# EAGLE design PowerBoard (EAGLE 9.2.0)
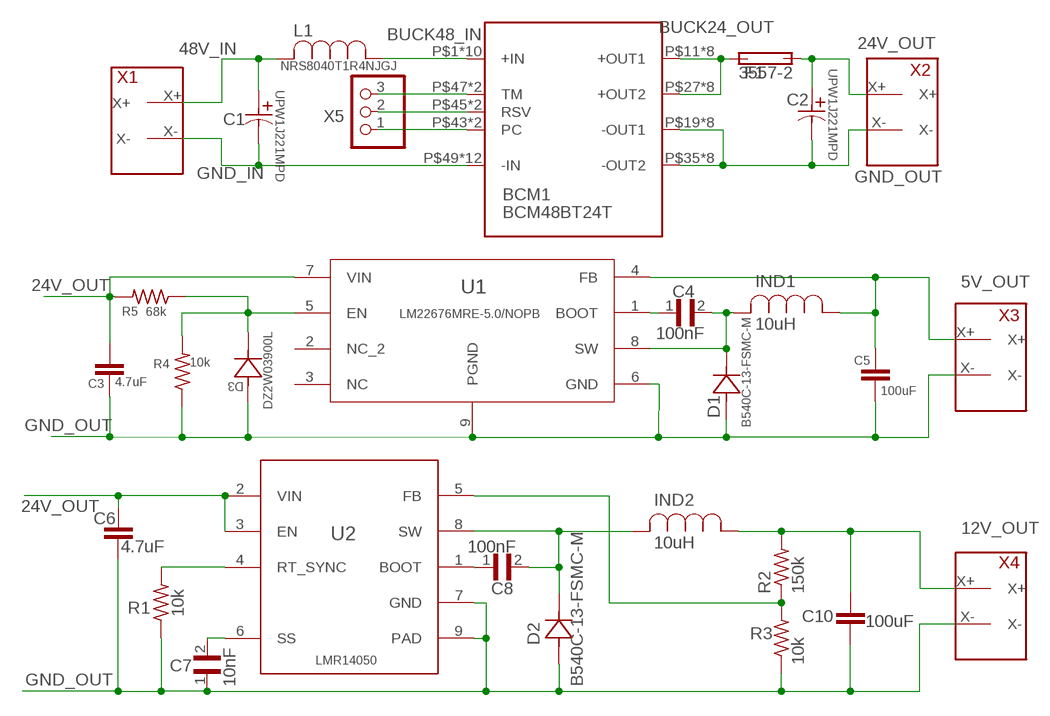
[diagram p0: schematic, sheet 1]

## Parts
BCM1  BCM48BT24T  [BCM48BT24T]
C1  UPW1J221MPD  [PCAP_10X20-THRU-ELECT]
C2  UPW1J221MPD  [PCAP_10X20-THRU-ELECT]
C3  4.7uF  4.7UF0603  [0603]
C4  100nF  GRM21BR60E107ME15L  [CAPC2012X135N]
C5  100uF  10UF-1210-50V-20%  [1210]
C6  4.7uF  4.7UF0603  [0603]
C7  10nF  GRM21BR60E107ME15L  [CAPC2012X135N]
C8  100nF  GRM21BR60E107ME15L  [CAPC2012X135N]
C10  100uF  10UF-1210-50V-20%  [1210]
D1  B540C-13-FSMC-M  [SMC-M]
D2  B540C-13-FSMC-M  [SMC-M]
D3  DZ2W03900L  [MINI2-F3-B]
F1  3557-2  [FUSE_3557-2]
IND1  10uH  ASPI-1040HIA  [11.15X10]
IND2  10uH  ASPI-1040HIA  [11.15X10]
L1  NRS8040T1R4NJGJ  [IND_TAIYO_NRS8040]
R1  10k  R-US_R0603  [R0603]
R2  150k  R-US_R0603  [R0603]
R3  10k  R-US_R0603  [R0603]
R4  10k  R-US_R0603  [R0603]
R5  68k  R-US_R0603  [R0603]
U1  LM22676MRE-5.0/NOPB  [MRA08B]
U2  LMR14050  LMR14050SDDAR  [DDA0008E_N]
X1  XT30U-M  [XT30]
X2  XT30U-M  [XT30]
X3  XT30U-M  [XT30]
X4  XT30U-M  [XT30]
X5  9-146281-0  [TE_9-146281-0]

## Nets
5V_BOOT [V5]: C4.1 U1.1(BOOT)
5V_EN [V5]: D3.1 R4.2 R5.1 U1.5(EN)
5V_IND [V5]: C4.2 D1.1 IND1.2 U1.8(SW)
5V_OUT [V5]: C5.1 IND1.1 U1.4(FB) X3.X+
12V_BOOT [V12]: C8.1 U2.1(BOOT)
12V_FB [V12]: R2.1 R3.2 U2.5(FB)
12V_OUT [V12]: C10.1 IND2.1 R2.2 X4.X+
12V_RT_SYNC [V12]: R1.2 U2.4(RT_SYNC)
12V_SS [V12]: C7.2 U2.6(SS)
12V_SW [V12]: C8.2 D2.1 IND2.2 U2.8(SW)
24V_OUT [V24]: C2.1 C3.1 C6.1 F1.3(2A) F1.4(2A) R5.2 U1.7(VIN) U2.2(VIN) U2.3(EN) X2.X+
48V_IN [V48]: C1.1 L1.2 X1.X+
48V_PC: BCM1.P$43(PC) BCM1.P$44(PC) X5.1
48V_RSV: BCM1.P$45(RSV) BCM1.P$46(RSV) X5.2
48V_TM: BCM1.P$47(TM) BCM1.P$48(TM) X5.3
BUCK24_OUT [V24]: BCM1.P$11(+OUT1) BCM1.P$12(+OUT1) BCM1.P$13(+OUT1) BCM1.P$14(+OUT1) BCM1.P$15(+OUT1) BCM1.P$16(+OUT1) BCM1.P$17(+OUT1) BCM1.P$18(+OUT1) BCM1.P$27(+OUT2) BCM1.P$28(+OUT2) BCM1.P$29(+OUT2) BCM1.P$30(+OUT2) BCM1.P$31(+OUT2) BCM1.P$32(+OUT2) BCM1.P$33(+OUT2) BCM1.P$34(+OUT2) F1.1(1A) F1.2(1A)
BUCK48_IN [V48]: BCM1.P$1(+IN) BCM1.P$2(+IN) BCM1.P$3(+IN) BCM1.P$4(+IN) BCM1.P$5(+IN) BCM1.P$6(+IN) BCM1.P$7(+IN) BCM1.P$8(+IN) BCM1.P$9(+IN) BCM1.P$10(+IN) L1.1
GND_IN [GND_IN]: BCM1.P$49(-IN) BCM1.P$50(-IN) BCM1.P$51(-IN) BCM1.P$52(-IN) BCM1.P$53(-IN) BCM1.P$54(-IN) BCM1.P$55(-IN) BCM1.P$56(-IN) BCM1.P$57(-IN) BCM1.P$58(-IN) BCM1.P$59(-IN) BCM1.P$60(-IN) C1.2 X1.X-
GND_OUT [GND_OUT]: BCM1.P$19(-OUT1) BCM1.P$20(-OUT1) BCM1.P$21(-OUT1) BCM1.P$22(-OUT1) BCM1.P$23(-OUT1) BCM1.P$24(-OUT1) BCM1.P$25(-OUT1) BCM1.P$26(-OUT1) BCM1.P$35(-OUT2) BCM1.P$36(-OUT2) BCM1.P$37(-OUT2) BCM1.P$38(-OUT2) BCM1.P$39(-OUT2) BCM1.P$40(-OUT2) BCM1.P$41(-OUT2) BCM1.P$42(-OUT2) C2.2 C3.2 C5.2 C6.2 C7.1 C10.2 D1.2 D2.2 D3.2 R1.1 R3.1 R4.1 U1.6(GND) U1.9(PGND) U2.7(GND) U2.9(PAD) X2.X- X3.X- X4.X-
Unconnected: U1.2(NC_2) U1.3(NC)

## Library data of the parts
BCM1 = BCM48BT24:BCM48BT24T
C1 C2 = CAP220uFTH:UPW1J221MPD; MANUFACTURER_PART_NUMBER: UPW1J221MPD; VENDOR: Nichicon
C3 C6 = SparkFun-Capacitors:4.7UF: 4.7µF ceramic capacitors A capacitor is a passive two-terminal electrical component used to store electrical energy temporarily in an electric field.; PROD_ID: CAP-08280
C4 C7 C8 = GRM21BR60E107ME15L:GRM21BR60E107ME15L: Cap Ceramic 100uF 2.5V X5R 20% SMD 0805 85°C Embossed Plastic T/R; AVAILABILITY: Unavailable; DESCRIPTION: Cap Ceramic 100uF 2.5V X5R 20% SMD 0805 85°C Embossed Plastic T/R; MF: Murata Electronics; MP: GRM21BR60E107ME15L; PACKAGE: 0805 Murata; PRICE: 0.64 USD
C5 C10 = SparkFun-Capacitors:10UF: 10.0µF ceramic capacitors A capacitor is a passive two-terminal electrical component used to store electrical energy temporarily in an electric field.; PROD_ID: CAP-09824; VALUE: 10uF
D1 D2 = DIO_B540C-13-FSMC:B540C-13-F; MANUFACTURER_PART_NUMBER: B540C13F; VENDOR: Diodes Inc
D3 = 3.9V_Zener_Diode:DZ2W03900L; MANUFACTURER_PART_NUMBER: DZ2W03900L; VENDOR: Panasonic
F1 = Fuse Holder 3557-2:3557-2: Clip; Auto Clips & Holders; 2-1 Holder For Standard & Low Profile Mini Fuses; AVAILABILITY: Good; DESCRIPTION: Clip; Auto Clips & Holders; 2-1 Holder For Standard & Low Profile Mini Fuses; MF: Keystone; MP: 3557-2; PACKAGE: None; PRICE: 0.82 USD
IND1 IND2 = IND_smd_10uH_7.5A:ASPI-1040HI
L1 = IND_smd_1uH_6A:NRS8040T1R4NJGJ; MANUFACTURER_PART_NUMBER: NRS8040T1R4NJGJ; VENDOR: TAIYO YUDEN
R1-R5 = resistor:R-US_: RESISTOR, American symbol
U1 = LM2267:LM22676MRE-5.0/NOPB; MANUFACTURER_PART_NUMBER: LM22676MRE5.0NOPB; VENDOR: National Semiconductor
U2 = 24vto12v:LMR14050SDDAR; APPLICATION_BUILDNUMBER: *; COMPTYPE: IC; MANUFACTURER: Texas Instruments; MANUFACTURER_NAME: Texas Instruments; MANUFACTURER_PART_NUMBER: LMR14050SDDAR; MOUNTTYPE: SMT; PACKAGEREFERENCE: DDA0008E; PARTNUMBER: LMR14050SDDAR; PIN_COUNT: 9; REFDES: RefDes; ROHS: Y; TYPE: TYPE; VALUE: Value
X1-X4 = XT30:XT30U-M
X5 = header_connector:9-146281-0: AMPMODU 40 Position Through-Hole Single Row Straight 2.54 mm Breakaway Header; AVAILABILITY: Good; CENTERLINE_PITCH: 2.54 mm[.1 in]; COMMENT: 9-146281-0; DESCRIPTION: 40 MODII HDR SRST B/A .100CL; EU_ROHS_COMPLIANCE: Compliant; LINK: http://www.te.com/usa-en/product-9-146281-0.html; MF: TE Connectivity; MP: 9-146281-0; NUMBER_OF_POSITIONS: 40; PACKAGE: FakePackage u; PRICE: 2.90 USD; PRODUCT_TYPE: Connector

## Net classes
0 default: width 0.406 mm, clearance 0.381 mm
1 V48: width 2.54 mm, clearance 0.381 mm
2 V24: width 0.889 mm, clearance 0.381 mm
3 V12: width 0.762 mm, clearance 0.381 mm
4 V5: width 0.889 mm, clearance 0.381 mm
5 GND_IN: width 2.54 mm, clearance 0.381 mm
6 GND_OUT: width 0.406 mm, clearance 0.381 mm

## Board
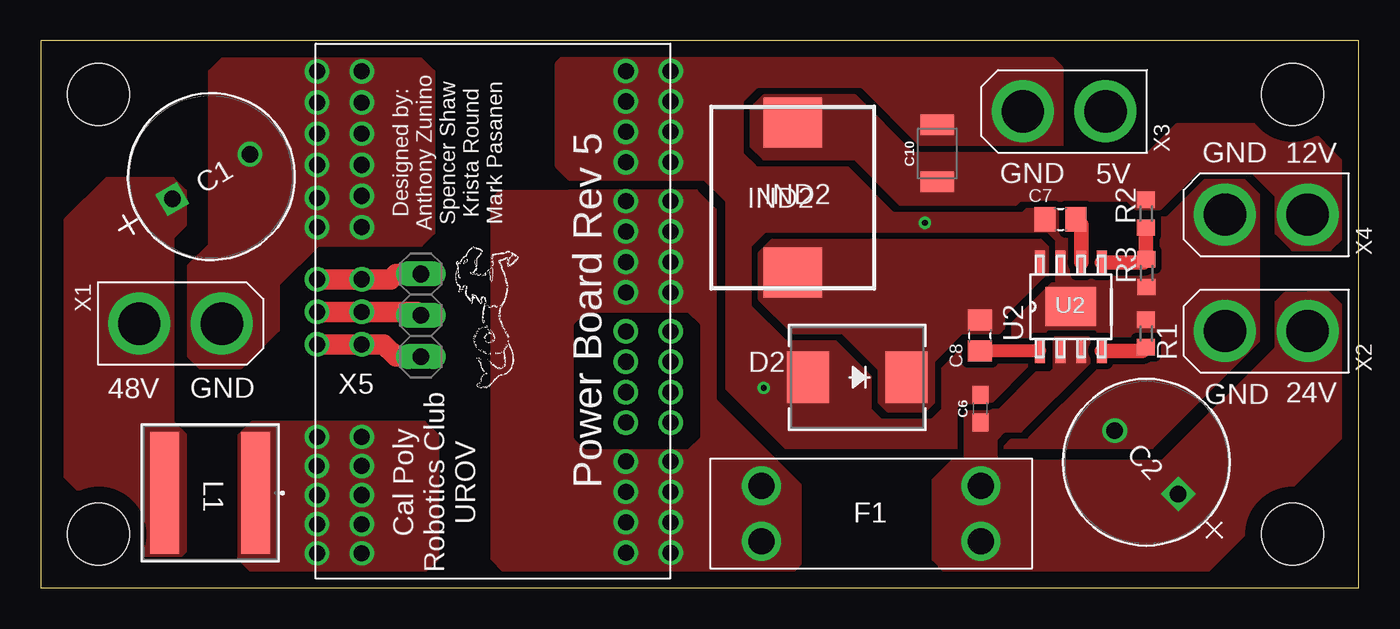
[diagram p1: board, top side]
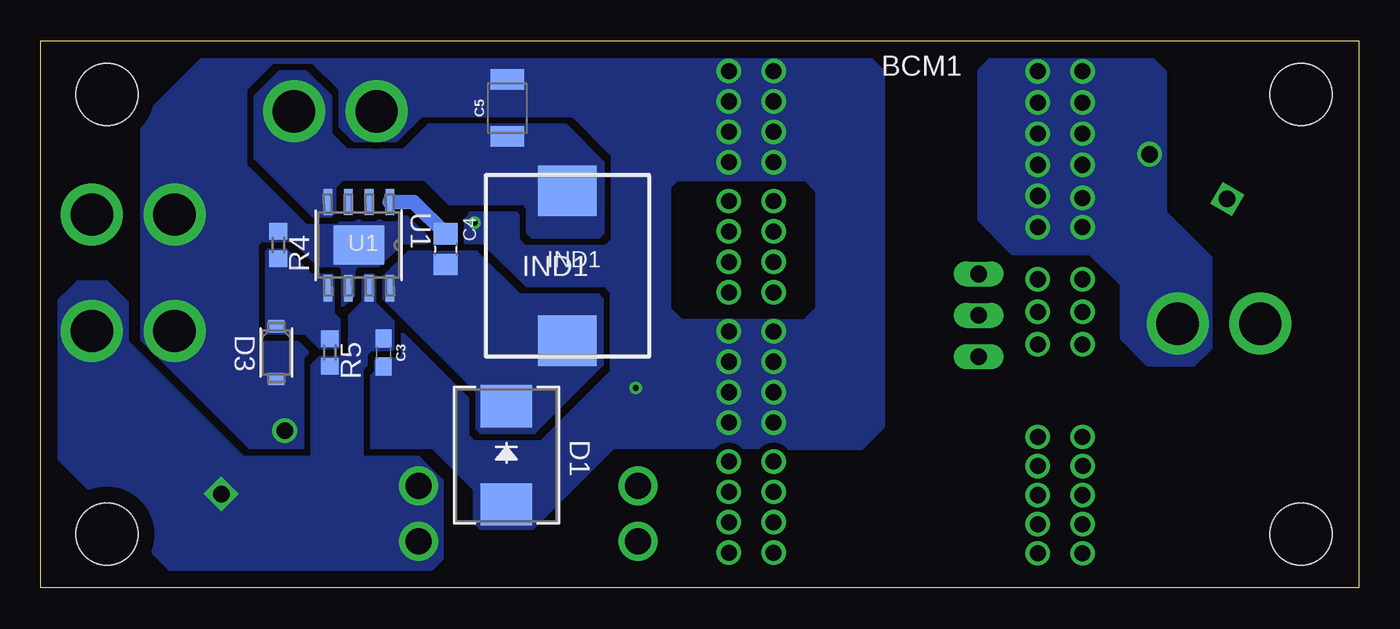
[diagram p2: board, bottom side, seen from below]

Size 81.03 x 33.66 mm. Coordinates in mm from the lower left corner, seen from the top.
Outline: 0,0 81.03,0 81.03,33.66 0,33.66 0,0
Copper layers (1*16): Top 0.035mm / dielectric 1.5mm / Bottom 0.035mm
Design rules "default": minimum track width 6mil, minimum drill 0.35mm, track to track 6mil, track to pad 6mil, pad to pad 6mil, via to via 6mil, smd to smd 6mil, copper to edge 40mil, drill to drill 6mil, minimum pad ring 10mil, minimum via ring 8mil, stop-mask expansion 4mil, vias tented up to drill 0mil, thermal gap 10mil
Holes 3.81 mm at 3.56,30.35 3.56,3.3 76.96,3.3 76.96,30.35
bRestrict: area 55.1,22.6 to 56.4,23.1

### Footprints (pad centres in the part's own frame; a part is rotated, then mirrored left to right if it is on the bottom)
BCM48BT24T = drill 0.99 pad 1.5: P$1 7.95,14.89; P$2 10.7,14.89; P$3 10.7,13.1; P$4 7.95,13.1; P$5 10.7,11.31; P$6 7.95,11.31; P$7 10.719,9.52; P$8 7.95,9.52; P$9 10.7,7.73; P$10 7.95,7.73; P$11 -11.04,14.85; P$12 -8.29,14.85; P$13 -11.04,12.98; P$14 -8.29,12.98; P$15 -11.04,11.11; P$16 -8.29,11.11; P$17 -11.04,9.24; P$18 -8.29,9.24; P$19 -11.04,6.85; P$20 -8.29,6.85; P$21 -11.04,4.98; P$22 -8.29,4.98; P$23 -11.04,3.11; P$24 -8.29,3.11; P$25 -11.04,1.24; P$26 -8.29,1.24; P$27 -11.04,-1.16; P$28 -8.29,-1.16; P$29 -11.04,-3.03; P$30 -8.29,-3.03; P$31 -11.04,-4.9; P$32 -8.29,-4.9; P$33 -11.04,-6.77; P$34 -8.29,-6.77; P$35 -11.04,-9.16; P$36 -8.29,-9.16; P$37 -11.04,-11.03; P$38 -8.29,-11.03; P$39 -11.04,-12.9; P$40 -8.29,-12.9; P$41 -11.04,-14.77; P$42 -8.29,-14.77; P$43 10.7,2.04; P$44 7.95,2.04; P$45 10.7,0.04; P$46 7.95,0.04; P$47 10.7,-1.96; P$48 7.95,-1.96; P$49 10.7,-5.17; P$50 7.95,-5.17; P$51 10.7,-6.96; P$52 7.95,-7.09; P$53 10.7,-9; P$54 7.95,-9; P$55 10.7,-10.92; P$56 7.95,-10.92; P$57 10.7,-12.83; P$58 7.95,-12.83; P$59 10.7,-14.75; P$60 7.95,-14.75
PCAP_10X20-THRU-ELECT = drill 1.016 pad 1.524 square: 1 -2.972,0 | drill 1.016 pad 1.524: 2 2.54,0
0603 = smd 1.1 x 1: 1 -0.85,0; 2 0.85,0
CAPC2012X135N = smd 1.3 x 1.5: 1 -0.95,0; 2 0.95,0
1210 = smd 1.27 x 2.06: 1 -1.755,0; 2 1.755,0
SMC-M = smd 2.587 x 3.18: 1 -3.026,0; 2 3.026,0
MINI2-F3-B = smd 0.762 x 0.991: 1 -1.626,0; 2 1.626,0
FUSE_3557-2 = drill 1.6: 1 -6.735,1.7; 2 -6.735,-1.7; 3 6.735,1.7; 4 6.735,-1.7
11.15X10 = smd 3.084 x 3.592: 1 -4.608,0; 2 4.608,0
IND_TAIYO_NRS8040 = smd 1.791 x 7.493: 1 -2.8,0; 2 2.8,0
R0603 = smd 1 x 1.1: 1 -0.85,0; 2 0.85,0
MRA08B = smd 1.6 x 0.533: 1 -2.654,1.905; 2 -2.654,0.635; 3 -2.654,-0.635; 4 -2.654,-1.905; 5 2.654,-1.905; 6 2.654,-0.635; 7 2.654,0.635; 8 2.654,1.905 | smd 2.413 x 3.099: 9 0,0
DDA0008E_N = smd 1.45 x 0.6: 1 -2.725,1.905; 2 -2.725,0.635; 3 -2.725,-0.635; 4 -2.725,-1.905; 5 2.725,-1.905; 6 2.725,-0.635; 7 2.725,0.635; 8 2.725,1.905 | smd 2.4 x 3.1: 9 0,0
XT30 = drill 2.603 pad 3.81: X+ 0,-2.54; X- 0,2.54
TE_9-146281-0 = drill 1.016 long: 1 1.27,0; 2 3.81,0; 3 6.35,0

### Placement (x,y rotation side)
BCM1  27.69,17.02 180 top
C1  10.67,25.4 30 top
C2  67.82,7.87 135 top
C3  59.94,14.48 270 bottom
C4  56.13,20.83 270 bottom
C5  52.35,29.51 90 bottom
C6  57.76,11.02 90 top
C7  62.69,22.66 0 top
C8  57.73,15.52 90 top
C10  55.12,26.72 90 top
D1  52.4,8.15 270 bottom
D2  50.19,12.95 180 top
D3  66.55,14.48 270 bottom
F1  51.05,4.57 0 top
IND1  48.64,19.81 270 bottom
IND2  46.23,24 270 top
L1  10.41,5.84 180 top
R1  67.94,15.65 270 top
R2  67.94,23.01 90 top
R3  67.97,19.35 90 top
R4  66.42,21.08 270 bottom
R5  63.25,14.48 270 bottom
U1  61.47,21.08 270 bottom
U2  63.32,17.3 90 top
X1  8.6,16.26 270 top
X2  75.34,15.8 90 top
X3  62.92,29.31 90 top
X4  75.34,22.96 90 top
X5  23.37,12.95 90 top

### Tracks (layer width: path | path; a pad name or v marks a point on that pad's centre or on a via)
5V_BOOT
  Bottom 0.889: C4.1 58.09,23.74 U1.1
5V_EN
  pour Bottom (no thermals): 64.39,19.3 63.12,19.3 62.99,19.18 62.99,16.89 62.61,16.51 62.61,14.86 62.74,14.73 63.88,14.73 64.01,14.86 64.77,15.62 66.42,15.62 67.06,15.62 67.18,15.75 67.18,20.7 67.06,20.83 65.91,20.83 65.79,20.7
5V_IND
  pour Bottom (no thermals): 54.23,12.06 54.23,9.78 53.98,9.53 50.67,9.53 46.48,13.72 46.48,17.78 46.74,18.03 51.56,18.03 54.23,20.7 58.42,20.7 59.94,19.18 59.94,17.78
5V_OUT
  pour Bottom (no thermals): 50.8,21.59 51.05,21.84 51.05,23.37 51.31,23.62 55.88,23.62 57.4,25.15 62.48,25.15 62.99,24.64 62.99,23.11 63.25,22.86 64.26,22.86 67.82,26.42 67.82,30.23 66.29,31.75 64.77,31.75 63.25,30.23 63.25,27.94 62.23,26.92 58.67,26.92 57.15,28.45 48.77,28.45 46.48,26.16 46.48,21.84 46.74,21.59
12V_BOOT
  Top 0.813: U2.1 C8.1
12V_FB
  Top 0.889: U2.5 67.79,20.02 R3.2 67.94,20.23 R2.1
12V_OUT
  Top 0.762: IND2.1 46.23,28
  pour Top (no thermals): 44.45,26.42 50.04,26.42 52.83,23.62 59.94,23.62 60.2,23.88 66.8,23.88 67.31,23.37 68.83,23.37 71.12,25.65 74.42,25.65 75.95,24.13 75.95,21.84 76.96,20.83 79.25,20.83 80.01,21.59 80.01,26.16 77.72,28.45 69.85,28.45 68.07,26.67 53.59,26.67 50.04,30.23 44.45,30.23 43.69,29.46 43.69,27.18
12V_RT_SYNC
  Top 0.889: R1.2 67.72,14.57 U2.4
12V_SS
  Top 0.889: C7.2 63.96,22.34 U2.6
12V_SW
  pour Top (no thermals): 61.47,21.34 44.96,21.34 44.2,20.57 44.2,17.78 46.23,15.75 49.28,15.75 51.56,13.46 51.56,11.43 52.07,10.92 54.36,10.92 54.86,11.43 54.86,13.97 56.64,15.75 58.93,15.75 59.18,16 59.18,16.76 61.72,19.3 61.98,19.3 61.98,20.83
24V_OUT
  pour Bottom (no thermals): 56.34,1.83 56.34,6.55 57.78,8 68.58,8 75.69,15.11 75.69,17.53 76.96,18.8 78.74,18.8 80.24,17.29 80.24,15.98 80.21,13.74 80.21,8.28 72.95,1.02 57.15,1.02
  pour Top (no thermals): 68.96,7.75 56.01,7.75 54.86,6.6 54.86,1.78 55.63,1.02 71.68,1.02 79.96,9.3 79.96,17.32 79.13,18.15 76.46,18.06 75.95,17.53 75.95,14.73
  pour Top (no thermals): 56.87,6.25 56.87,10.64 57.15,10.92 58.95,10.92 61.24,13.21 62.1,13.21 62.36,13.46 62.36,15.37 64.39,15.37 64.39,13.84 60.2,9.65 59.18,9.65 58.68,9.15 58.7,6.25
  pour Bottom (no thermals): 62.36,14.22 63.88,14.22 64.39,13.72 64.39,6.73 61.21,6.73 61.21,13.46 60.96,13.72 60.96,14.35 60.71,14.61 59.44,14.61 59.31,14.73 59.31,16.38 60.45,17.53 60.45,19.18 60.58,19.3 61.09,19.3 61.28,19.11 61.28,17.59 62.1,16.76 62.1,14.48
48V_IN
  pour Top (no thermals): 8.89,22.35 8.89,24.38 8.13,25.15 4.06,25.15 1.52,22.61 1.52,6.86 6.35,2.03 8.64,2.03 8.89,2.29 8.89,9.4 8.13,10.16 8.13,21.59
48V_PC
  Top 1.27: BCM1.P$43 BCM1.P$44 21.09,14.98 21.84,14.22 X5.1
48V_RSV
  Top 1.27: BCM1.P$45 BCM1.P$46 23.15,16.98 X5.2
48V_TM
  Top 1.27: BCM1.P$47 BCM1.P$48 21.52,18.98 21.84,19.3 X5.3
BUCK24_OUT
  pour Top (no thermals): 46.69,6.3 41.45,11.53 41.45,23.22 40.28,24.38 32.51,24.38 31.75,23.62 31.75,17.78 32.46,17.07 39.83,17.07 40.64,16.26 40.64,9.19 39.83,8.38 32.51,8.38 31.75,7.62 31.75,1.83 32.51,1.07 46.23,1.07 46.69,1.52
  pour Top: 39.12,24.33 28.24,24.33 27.74,23.83 27.74,1.83 28.5,1.07 39.32,1.07 39.83,1.57 39.83,7.57 39.01,8.38 33.43,8.38 32.66,9.14 32.66,16.26 33.48,17.07 39.17,17.07 39.93,17.83 39.93,23.52
BUCK48_IN
  pour Top (no thermals): 24.38,1.83 24.38,9.35 23.57,10.16 13,10.16 12.19,9.35 12.19,1.83 13,1.02 23.57,1.02
GND_IN
  pour Top (no thermals): 11.18,32.51 23.37,32.51 24.13,31.75 24.13,21.84 23.37,21.08 17.02,21.08 14.58,18.64 14.58,15.85 12.29,13.56 9.8,13.56 9.14,14.22 9.14,19.81 10.41,21.08 10.41,31.75
  pour Bottom (no thermals): 12.75,32.56 11.94,31.75 11.94,23.11 9.14,20.32 9.14,14.73 10.16,13.72 12.95,13.72 14.58,15.34 14.58,18.64 16.51,20.57 21.29,20.57 23.32,22.61 23.32,31.8 22.56,32.56
GND_OUT  (via drill 0.35)
  other vias: 44.45,12.29 54.36,22.45
  pour Bottom (isolate 0.254, rank 2, no thermals): 35.66,16.41 41.63,16.41 42.37,17.14 42.37,24.69 41.91,25.15 34.04,25.15 33.27,25.91 33.27,32.26 34.04,33.02 70.61,33.02 74.83,28.8 74.83,15.32 68.17,8.66 56.9,8.64 54.36,6.09 54.36,4.06 53.98,3.68 50.8,3.68 45.82,8.66 36.14,8.66 35.33,9.47 35.33,16.08
  pour Top (isolate 0.254, rank 3, no thermals): 40.84,25.15 32.51,25.15 31.75,25.91 31.75,32.26 32.77,33.27 61.47,33.27 62.74,32 62.74,26.16 73.41,26.16 74.83,24.74 74.83,15.19 68.28,8.64 45.82,8.64 42.21,12.24 42.21,23.77
  pour Bottom (no thermals): 34.09,25.2 38.4,25.2 38.76,25.55 38.76,32.11 38.32,32.55 30.11,32.6 29.26,31.75 29.26,9.91 30.58,8.59 36.02,8.59 36.17,8.74 36.17,16.41 34.09,16.41 33.27,17.22 33.27,24.38

### Text on the board
tPlace: Designed by: / Anthony Zunino / Spencer Shaw / Krista Round / Mark Pasanen | GND | 12V | GND | 5V | IND2 | Power Board Rev 5 | U2 | 48V | GND | GND | 24V | Cal Poly / Robotics Club / UROV
bPlace: U1 | IND1